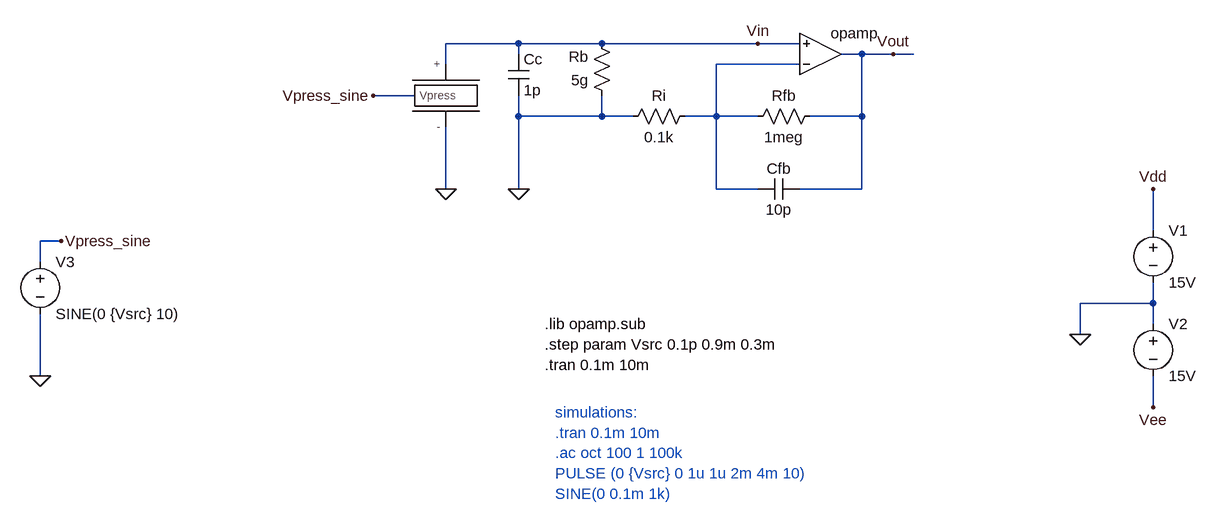
[diagram p0: schematic VoltageModeAmplifier2.asc]
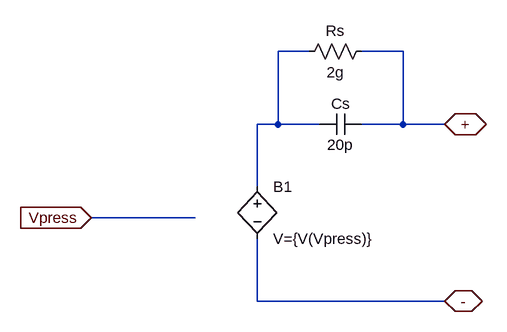
[diagram p1: sub-circuit sensor_pze_simple.asc]
VoltageModeAmplifier2.asc, the LTspice schematic file:
Version 4
SHEET 1 1256 680
WIRE 208 -48 96 -48
WIRE 336 -48 208 -48
WIRE 576 -48 336 -48
WIRE 640 -48 576 -48
WIRE 208 -32 208 -48
WIRE 736 -32 704 -32
WIRE 784 -32 736 -32
WIRE 816 -32 784 -32
WIRE 96 -16 96 -48
WIRE 640 -16 512 -16
WIRE 48 32 -16 32
WIRE 208 64 208 32
WIRE 336 64 336 32
WIRE 336 64 208 64
WIRE 384 64 336 64
WIRE 512 64 512 -16
WIRE 512 64 464 64
WIRE 576 64 512 64
WIRE 736 64 736 -32
WIRE 736 64 656 64
WIRE 96 176 96 80
WIRE 208 176 208 64
WIRE 512 176 512 64
WIRE 576 176 512 176
WIRE 736 176 736 64
WIRE 736 176 640 176
WIRE 1184 240 1184 176
WIRE -496 256 -528 256
WIRE -528 288 -528 256
WIRE 1184 352 1184 320
WIRE 1184 352 1072 352
WIRE 1184 384 1184 352
WIRE 1072 400 1072 352
WIRE -528 464 -528 368
WIRE 1184 512 1184 464
FLAG 1072 400 0
FLAG 1184 176 Vdd
FLAG 1184 512 Vee
FLAG 208 176 0
FLAG -528 464 0
FLAG 784 -32 Vout
FLAG -496 256 Vpress_sine
FLAG 576 -48 Vin
FLAG 96 176 0
FLAG -16 32 Vpress_sine
SYMBOL voltage 1184 224 R0
SYMATTR InstName V1
SYMATTR Value 15V
SYMBOL voltage 1184 368 R0
SYMATTR InstName V2
SYMATTR Value 15V
SYMBOL voltage -528 272 R0
SYMATTR InstName V3
SYMATTR Value SINE(0 {Vsrc} 10)
SYMATTR Value2 AC 1m
SYMBOL Opamps/opamp 672 32 M180
WINDOW 0 0 32 Invisible 2
SYMATTR InstName U2
SYMBOL cap 640 160 R90
WINDOW 0 0 32 VBottom 2
WINDOW 3 32 32 VTop 2
SYMATTR InstName Cfb
SYMATTR Value 10p
SYMBOL res 480 48 R90
WINDOW 0 0 56 VBottom 2
WINDOW 3 32 56 VTop 2
SYMATTR InstName Ri
SYMATTR Value 0.1k
SYMBOL cap 192 -32 R0
SYMATTR InstName Cc
SYMATTR Value 1p
SYMBOL res 352 48 R180
WINDOW 0 36 76 Left 2
WINDOW 3 36 40 Left 2
SYMATTR InstName Rb
SYMATTR Value 5g
SYMBOL res 672 48 R90
WINDOW 0 0 56 VBottom 2
WINDOW 3 32 56 VTop 2
SYMATTR InstName Rfb
SYMATTR Value 1meg
SYMBOL SENSOR_PZE_SIMPLE 96 32 R0
WINDOW 0 56 4 Invisible 2
SYMATTR InstName X1
TEXT 248 384 Left 2 !.lib opamp.sub\n.step param Vsrc 0.1p 0.9m 0.3m\n.tran 0.1m 10m
TEXT 264 520 Left 2 ;simulations:\n.tran 0.1m 10m\n.ac oct 100 1 100k\nPULSE (0 {Vsrc} 0 1u 1u 2m 4m 10)\nSINE(0 0.1m 1k)

sensor_pze_simple.asc, the sub-circuit schematic file:
Version 4
SHEET 1 960 940
WIRE -176 496 -224 496
WIRE -32 496 -96 496
WIRE -224 608 -224 496
WIRE -224 608 -256 608
WIRE -160 608 -224 608
WIRE -32 608 -32 496
WIRE -32 608 -96 608
WIRE 32 608 -32 608
WIRE -256 704 -256 608
WIRE -352 752 -512 752
WIRE -256 880 -256 784
WIRE 32 880 -256 880
FLAG -512 752 Vpress
IOPIN -512 752 In
FLAG 32 608 +
IOPIN 32 608 BiDir
FLAG 32 880 -
IOPIN 32 880 BiDir
SYMBOL cap -96 592 R90
WINDOW 0 0 32 VBottom 2
WINDOW 3 32 32 VTop 2
SYMATTR InstName Cs
SYMATTR Value 20p
SYMBOL res -80 480 R90
WINDOW 0 0 56 VBottom 2
WINDOW 3 32 56 VTop 2
SYMATTR InstName Rs
SYMATTR Value 2g
SYMBOL bv -256 688 R0
SYMATTR InstName B1
SYMATTR Value V={V(Vpress)}

The netlist it stands for:
* VoltageModeAmplifier2.asc
V1 Vdd 0 15V
V2 0 Vee 15V
V3 Vpress_sine 0 SINE(0 {Vsrc} 10) AC 1m
XU2 N001 Vin Vout opamp Aol=100K GBW=10Meg  ; pins invin noninvin out
Cfb Vout N001 10p
Ri N001 0 0.1k
Cc Vin 0 1p
Rb 0 Vin 5g
Rfb Vout N001 1meg
XX1 Vpress_sine Vin 0 sensor_pze_simple

* block symbol definitions
.subckt sensor_pze_simple Vpress + -
Cs + N001 20p
Rs + N001 2g
B1 N001 - V={V(Vpress)}
.ends sensor_pze_simple

.lib opamp.sub
.step param Vsrc 0.1p 0.9m 0.3m
.tran 0.1m 10m
* simulations:
* .tran 0.1m 10m
* .ac oct 100 1 100k
* PULSE (0 {Vsrc} 0 1u 1u 2m 4m 10)
* SINE(0 0.1m 1k)
.backanno
.end